# Altium schematic sheet [01] - TOP VIEW.SchDoc
size A4; DocumentNumber: 1; SheetNumber: 1; SheetTotal: 5; Folha: Top View
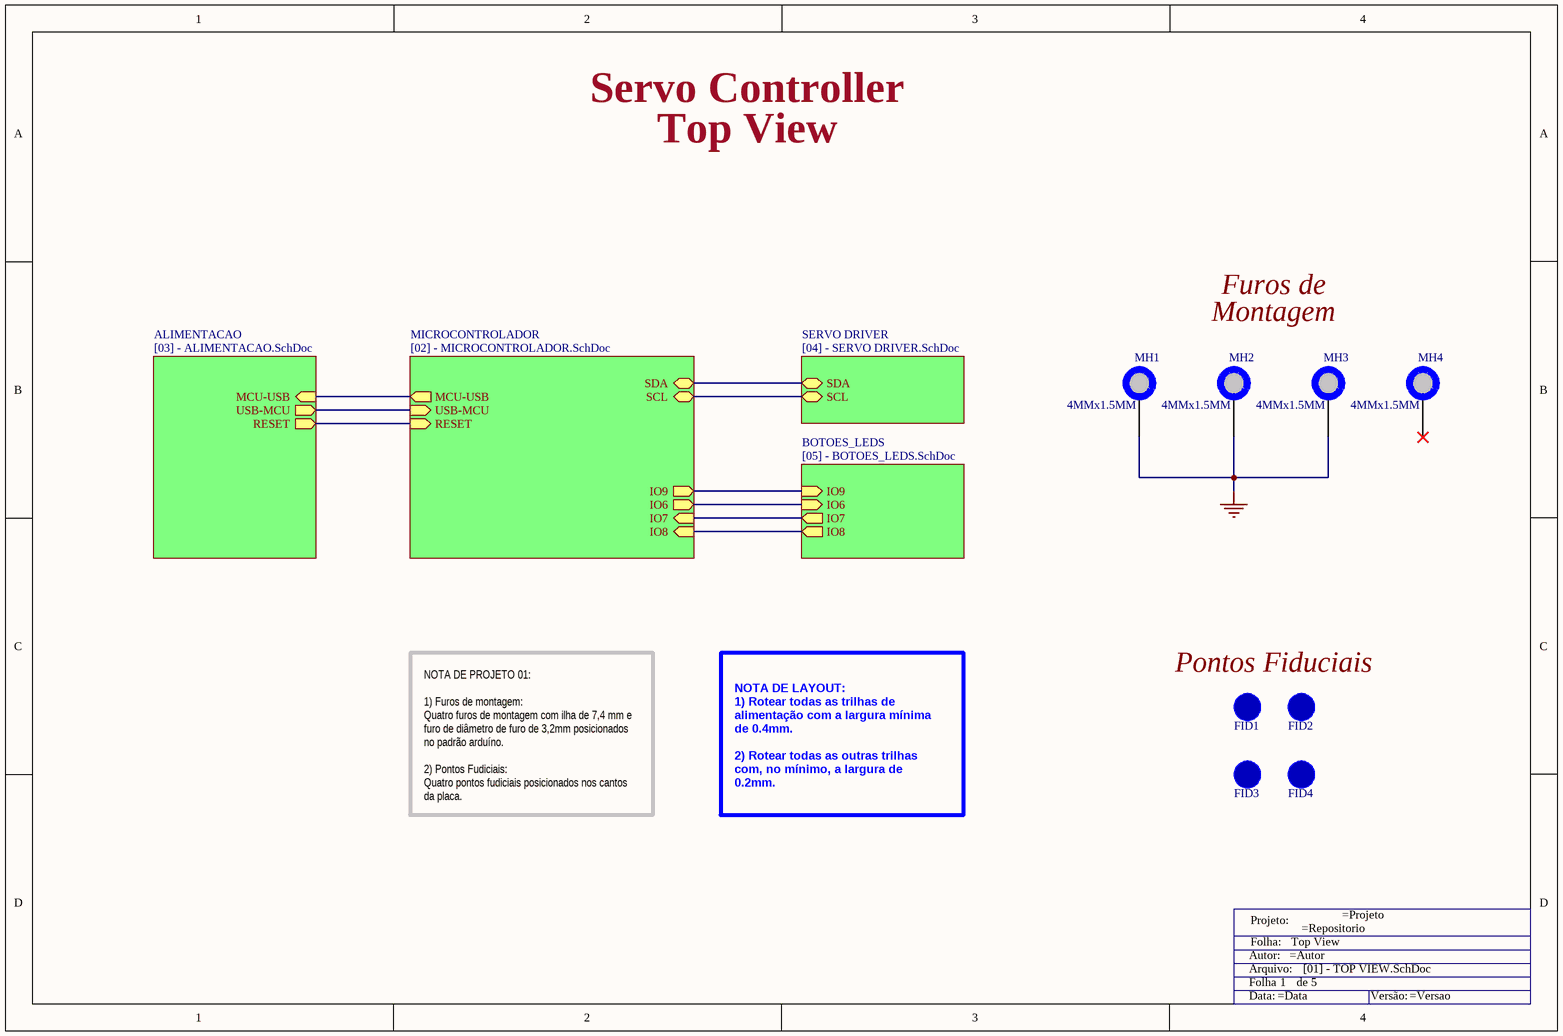
[diagram p0: [01] - TOP VIEW.SchDoc]

## Parts
FID1  FID_1MMC  [FID_40X120D]  (value not drawn)  (no BOM)
FID2  FID_1MMC  [FID_40X120D]  (value not drawn)  (no BOM)
FID3  FID_1MMC  [FID_40X120D]  (value not drawn)  (no BOM)
FID4  FID_1MMC  [FID_40X120D]  (value not drawn)  (no BOM)
MH1  4MMx1.5MM  [MH_7.4MMD_3.2MMD]  (no BOM)
MH2  4MMx1.5MM  [MH_7.4MMD_3.2MMD]  (no BOM)
MH3  4MMx1.5MM  [MH_7.4MMD_3.2MMD]  (no BOM)
MH4  4MMx1.5MM  [MH_7.4MMD_3.2MMD_NON_COPPER_NPTH]  (no BOM)
TitleBlock1  Title Block  (value not drawn)  (graphical)

## Sub-sheets
ALIMENTACAO = [03] - ALIMENTACAO.SchDoc: MCU-USB (in), USB-MCU (out), RESET (out)
BOTOES_LEDS = [05] - BOTOES_LEDS.SchDoc: IO7 (out), IO8 (out), IO6 (in), IO9 (in)
MICROCONTROLADOR = [02] - MICROCONTROLADOR.SchDoc: USB-MCU (in), MCU-USB (out), RESET (in), SDA (bidir), SCL (bidir), IO9 (out), IO6 (out), IO7 (in), IO8 (in)
SERVO DRIVER = [04] - SERVO DRIVER.SchDoc: SDA (bidir), SCL (bidir)

## Nets
GND: MH1.1 MH2.1 MH3.1
(unnamed): sheet ALIMENTACAO/MCU-USB, sheet MICROCONTROLADOR/MCU-USB
(unnamed): sheet ALIMENTACAO/USB-MCU, sheet MICROCONTROLADOR/USB-MCU
(unnamed): sheet ALIMENTACAO/RESET, sheet MICROCONTROLADOR/RESET
(unnamed): sheet MICROCONTROLADOR/SDA, sheet SERVO DRIVER/SDA
(unnamed): sheet MICROCONTROLADOR/SCL, sheet SERVO DRIVER/SCL
(unnamed): sheet MICROCONTROLADOR/IO9, sheet BOTOES_LEDS/IO9
(unnamed): sheet MICROCONTROLADOR/IO6, sheet BOTOES_LEDS/IO6
(unnamed): sheet MICROCONTROLADOR/IO7, sheet BOTOES_LEDS/IO7
(unnamed): sheet MICROCONTROLADOR/IO8, sheet BOTOES_LEDS/IO8

Not connected (* = marked no-connect by the designer): MH4 1*

## Notes on the sheet
- Servo Controller
- Top View
- Furos de
- Montagem
- Pontos Fiduciais
- NOTA DE LAYOUT:
  1) Rotear todas as trilhas de alimentação com a largura mínima de 0.4mm.
  2) Rotear todas as outras trilhas com, no mínimo, a largura de  0.2mm.
- NOTA DE PROJETO 01:
  1) Furos de montagem:
  Quatro furos de montagem com ilha de 7,4 mm e furo de diâmetro de furo de 3,2mm posicionados no padrão arduíno.
  2) Pontos Fudiciais:
  Quatro pontos fudiciais posicionados nos cantos da placa.
- (in symbol Title Block) Projeto:; Folha:; Autor:; Arquivo:; Folha; de; Data:; Versão:

## Library data of the parts
FID1-FID4 = FID_1MMC: Fiducial 40mil Diameter, 120mil Mask
MH1-MH4 = PAD_WITH_HOLE_4MMx1.5MM: Pad with a hole 4mm x 1.5mm